# EAGLE design UBTB_MIX_old (EAGLE 9.4.2)
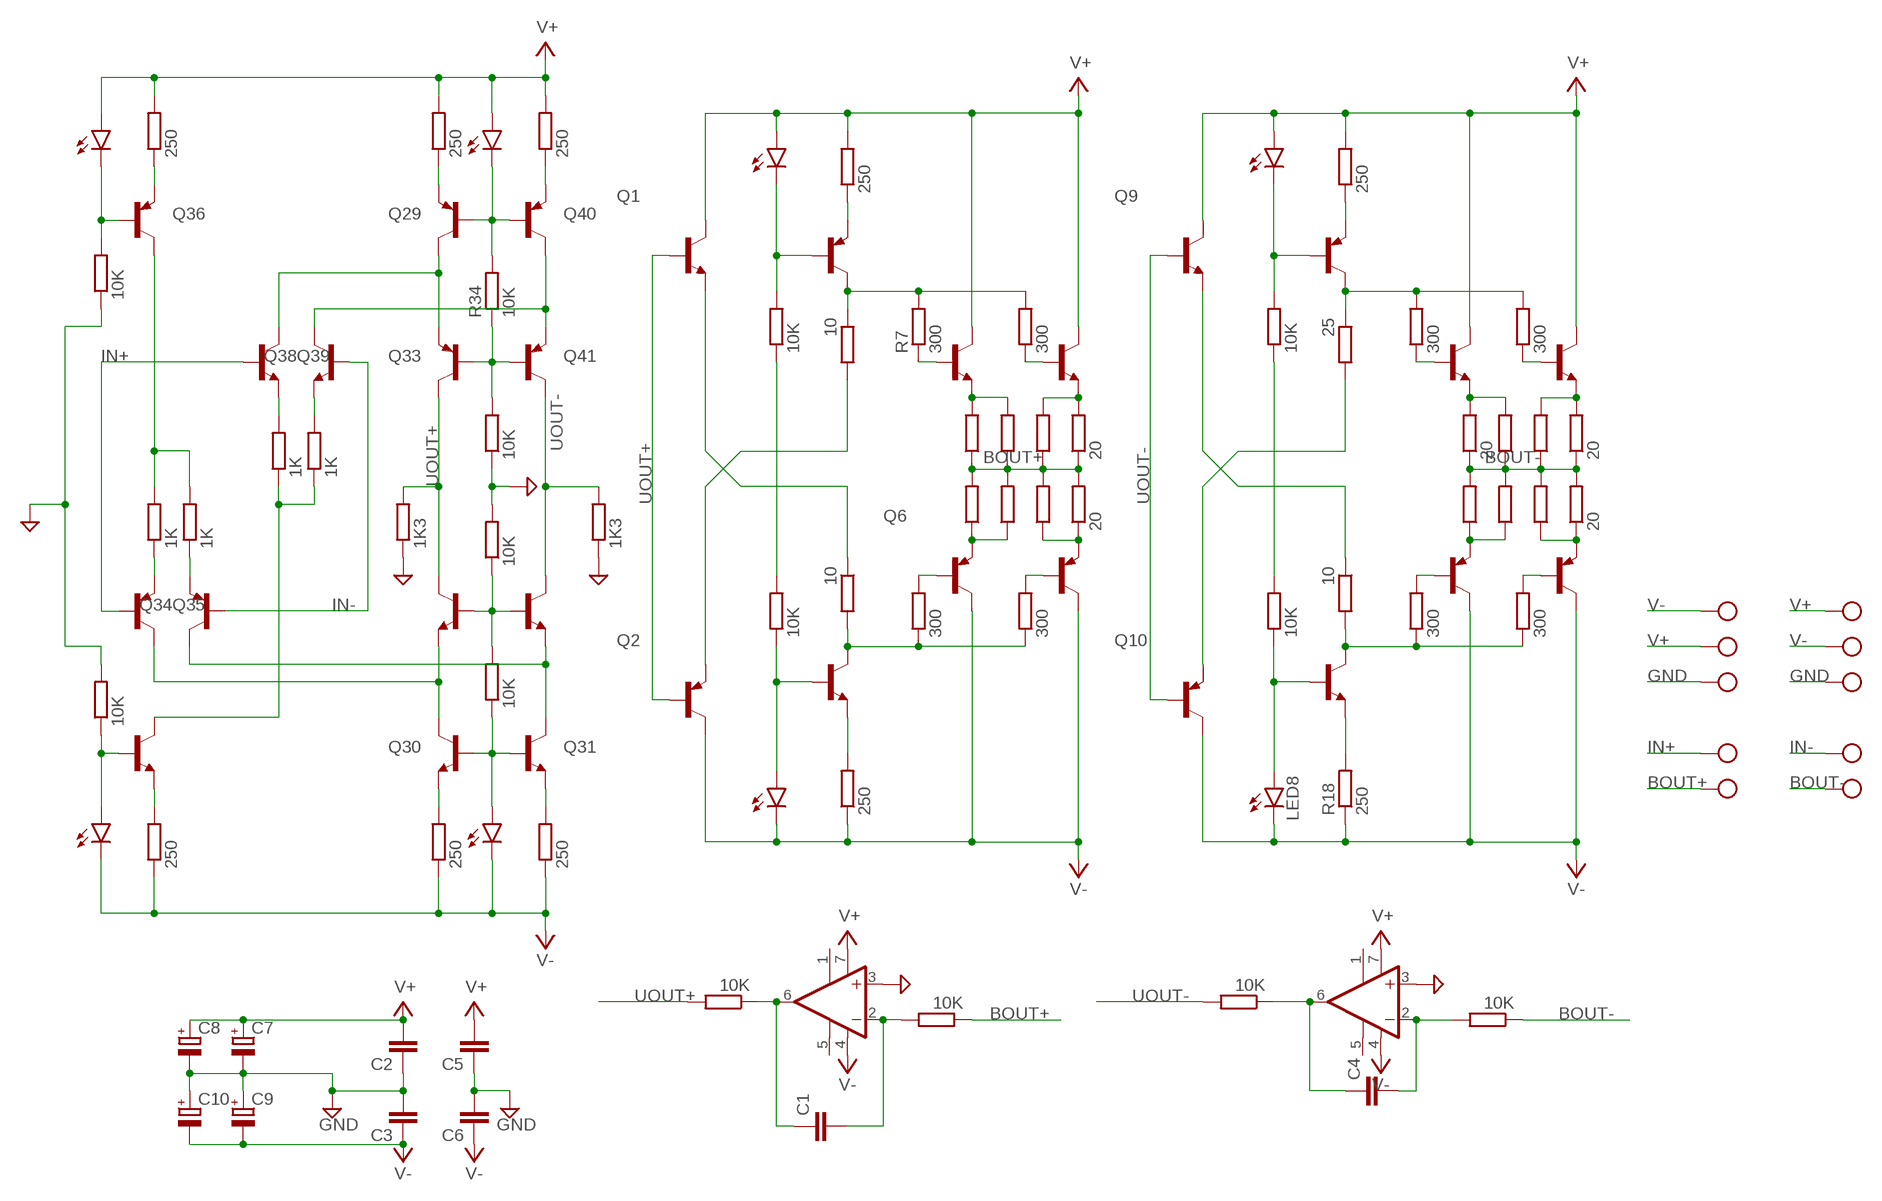
[diagram p0: schematic, sheet 1]

## Parts
C1  C-EUC1206  [C1206]
C2  C-EUC0805  [C0805]
C3  C-EUC0805  [C0805]
C4  C-EUC1206  [C1206]
C5  C-EUC0805  [C0805]
C6  C-EUC0805  [C0805]
C7  CPOL-EUF  [PANASONIC_F]
C8  CPOL-EUF  [PANASONIC_F]
C9  CPOL-EUF  [PANASONIC_F]
C10  CPOL-EUF  [PANASONIC_F]
IC1  OPA627U  [SO08]
IC2  OPA627U  [SO08]
LED1  LEDCHIPLED_1206  [CHIPLED_1206]
LED2  LEDCHIPLED_1206  [CHIPLED_1206]
LED3  LEDCHIPLED_1206  [CHIPLED_1206]
LED4  LEDCHIPLED_1206  [CHIPLED_1206]
LED5  LEDCHIPLED_1206  [CHIPLED_1206]
LED6  LEDCHIPLED_1206  [CHIPLED_1206]
LED7  LEDCHIPLED_1206  [CHIPLED_1206]
LED8  LEDCHIPLED_1206  [CHIPLED_1206]
Q1  TRANSISTOR_BC846-NPN-SOT23-BEC  [TRANSISTOR_SOT23-BEC]
Q2  TRANSISTOR_BC856B-PNP-SOT23-BEC  [TRANSISTOR_SOT23-BEC]
Q3  TRANSISTOR_BC846-NPN-SOT23-BEC  [TRANSISTOR_SOT23-BEC]
Q4  TRANSISTOR_BC856B-PNP-SOT23-BEC  [TRANSISTOR_SOT23-BEC]
Q5  TRANSISTOR_BC846-NPN-SOT23-BEC  [TRANSISTOR_SOT23-BEC]
Q6  TRANSISTOR_BC856B-PNP-SOT23-BEC  [TRANSISTOR_SOT23-BEC]
Q7  TRANSISTOR_BC856B-PNP-SOT23-BEC  [TRANSISTOR_SOT23-BEC]
Q8  TRANSISTOR_BC846-NPN-SOT23-BEC  [TRANSISTOR_SOT23-BEC]
Q9  TRANSISTOR_BC846-NPN-SOT23-BEC  [TRANSISTOR_SOT23-BEC]
Q10  TRANSISTOR_BC856B-PNP-SOT23-BEC  [TRANSISTOR_SOT23-BEC]
Q11  TRANSISTOR_BC846-NPN-SOT23-BEC  [TRANSISTOR_SOT23-BEC]
Q12  TRANSISTOR_BC856B-PNP-SOT23-BEC  [TRANSISTOR_SOT23-BEC]
Q13  TRANSISTOR_BC846-NPN-SOT23-BEC  [TRANSISTOR_SOT23-BEC]
Q14  TRANSISTOR_BC846-NPN-SOT23-BEC  [TRANSISTOR_SOT23-BEC]
Q15  TRANSISTOR_BC856B-PNP-SOT23-BEC  [TRANSISTOR_SOT23-BEC]
Q16  TRANSISTOR_BC856B-PNP-SOT23-BEC  [TRANSISTOR_SOT23-BEC]
Q26  BC847CSMD  [SOT23]
Q29  BC857CSMD  [SOT23-BEC]
Q30  BC847CSMD  [SOT23]
Q31  BC847CSMD  [SOT23]
Q32  BC847CSMD  [SOT23]
Q33  BC857CSMD  [SOT23-BEC]
Q34  BC857CSMD  [SOT23-BEC]
Q35  BC857CSMD  [SOT23-BEC]
Q36  BC857CSMD  [SOT23-BEC]
Q37  BC847CSMD  [SOT23]
Q38  BC847CSMD  [SOT23]
Q39  BC847CSMD  [SOT23]
Q40  BC857CSMD  [SOT23-BEC]
Q41  BC857CSMD  [SOT23-BEC]
R1  250  R-EU_MELF0204W  [MINI_MELF-0204W]
R2  250  R-EU_MELF0204W  [MINI_MELF-0204W]
R3  10K  R-EU_MELF0204W  [MINI_MELF-0204W]
R4  10K  R-EU_MELF0204W  [MINI_MELF-0204W]
R5  10  R-EU_MELF0204W  [MINI_MELF-0204W]
R6  10  R-EU_MELF0204W  [MINI_MELF-0204W]
R7  300  R-EU_MELF0204W  [MINI_MELF-0204W]
R8  300  R-EU_MELF0204W  [MINI_MELF-0204W]
R9  300  R-EU_MELF0204W  [MINI_MELF-0204W]
R10  300  R-EU_MELF0204W  [MINI_MELF-0204W]
R11  R-EU_MELF0204W  [MINI_MELF-0204W]
R12  R-EU_MELF0204W  [MINI_MELF-0204W]
R13  20  R-EU_MELF0204W  [MINI_MELF-0204W]
R14  20  R-EU_MELF0204W  [MINI_MELF-0204W]
R15  250  R-EU_MELF0204W  [MINI_MELF-0204W]
R16  10K  R-EU_MELF0204W  [MINI_MELF-0204W]
R17  10K  R-EU_MELF0204W  [MINI_MELF-0204W]
R18  250  R-EU_MELF0204W  [MINI_MELF-0204W]
R19  10K  R-EU_MELF0204W  [MINI_MELF-0204W]
R20  10K  R-EU_MELF0204W  [MINI_MELF-0204W]
R21  25  R-EU_MELF0204W  [MINI_MELF-0204W]
R22  250  R-EU_MELF0204W  [MINI_MELF-0204W]
R23  250  R-EU_MELF0204W  [MINI_MELF-0204W]
R24  10  R-EU_MELF0204W  [MINI_MELF-0204W]
R25  300  R-EU_MELF0204W  [MINI_MELF-0204W]
R26  300  R-EU_MELF0204W  [MINI_MELF-0204W]
R27  300  R-EU_MELF0204W  [MINI_MELF-0204W]
R28  300  R-EU_MELF0204W  [MINI_MELF-0204W]
R29  10K  R-EU_MELF0204W  [MINI_MELF-0204W]
R30  20  R-EU_MELF0204W  [MINI_MELF-0204W]
R31  R-EU_MELF0204W  [MINI_MELF-0204W]
R32  10K  R-EU_MELF0204W  [MINI_MELF-0204W]
R33  10K  R-EU_MELF0204W  [MINI_MELF-0204W]
R34  10K  R-EU_MELF0204W  [MINI_MELF-0204W]
R35  250  R-EU_MELF0204W  [MINI_MELF-0204W]
R36  250  R-EU_MELF0204W  [MINI_MELF-0204W]
R37  1K3  R-EU_MELF0204W  [MINI_MELF-0204W]
R38  1K3  R-EU_MELF0204W  [MINI_MELF-0204W]
R39  1K  R-EU_MELF0204W  [MINI_MELF-0204W]
R40  1K  R-EU_MELF0204W  [MINI_MELF-0204W]
R41  1K  R-EU_MELF0204W  [MINI_MELF-0204W]
R42  1K  R-EU_MELF0204W  [MINI_MELF-0204W]
R43  250  R-EU_MELF0204W  [MINI_MELF-0204W]
R44  250  R-EU_MELF0204W  [MINI_MELF-0204W]
R45  10K  R-EU_MELF0204W  [MINI_MELF-0204W]
R46  10K  R-EU_MELF0204W  [MINI_MELF-0204W]
R47  20  R-EU_MELF0204W  [MINI_MELF-0204W]
R48  10K  R-EU_MELF0204W  [MINI_MELF-0204W]
R49  20  R-EU_MELF0204W  [MINI_MELF-0204W]
R50  R-EU_MELF0204W  [MINI_MELF-0204W]
R51  10K  R-EU_MELF0204W  [MINI_MELF-0204W]
R52  R-EU_MELF0204W  [MINI_MELF-0204W]
R53  R-EU_MELF0204W  [MINI_MELF-0204W]
R54  R-EU_MELF0204W  [MINI_MELF-0204W]
R55  R-EU_MELF0204W  [MINI_MELF-0204W]
R56  R-EU_MELF0204W  [MINI_MELF-0204W]
R57  R-EU_MELF0204W  [MINI_MELF-0204W]
R58  R-EU_MELF0204W  [MINI_MELF-0204W]
X1  CON-PHOENIX-508_MKDSN1,5/3-5,08  [CON-PHOENIX-508_MKDSN1,5/3-5,08]
X2  CON-PHOENIX-508_MKDSN1,5/3-5,08  [CON-PHOENIX-508_MKDSN1,5/3-5,08]
X3  CON-PHOENIX-508_MKDSN1,5/2-5,08  [CON-PHOENIX-508_MKDSN1,5/2-5,08]
X4  CON-PHOENIX-508_MKDSN1,5/2-5,08  [CON-PHOENIX-508_MKDSN1,5/2-5,08]

## Nets
BOUT+: R11.1 R12.2 R13.1 R14.2 R17.1 R50.1 R52.1 R53.2 R54.2 X3.2
BOUT-: R30.1 R31.2 R47.1 R48.1 R49.2 R55.1 R56.1 R57.2 R58.2 X4.2
GND: C2.1 C3.2 C5.1 C6.2 C7.- C8.- C9.+ C10.+ IC1.3(+IN) IC2.3(+IN) R32.2 R33.1 R37.1 R38.1 R45.1 R46.2 X1.3 X2.3
IN+: Q35.B Q39.1(B) X3.1
IN-: Q34.B Q38.1(B) X4.1
N$1: C4.1 IC2.6(OUT) R51.1
N$3: C4.2 IC2.2(-IN) R48.2
N$4: Q2.E R5.2
N$5: Q3.E R2.2
N$6: Q4.E R1.1
N$7: LED5.C Q4.B R3.2
N$8: LED6.A Q3.B R4.1
N$9: Q4.C R5.1 R7.2 R10.2
N$10: Q3.C R6.2 R8.1 R9.1
N$11: Q1.E R6.1
N$12: R3.1 R4.2
N$13: Q5.B R7.1
N$14: Q5.E R11.2 R50.2
N$15: Q7.B R9.2
N$16: Q8.B R10.1
N$17: Q6.B R8.2
N$18: Q6.E R12.1 R53.1
N$19: C1.2 IC1.2(-IN) R17.2
N$20: Q8.E R13.2 R52.2
N$21: Q7.E R14.1 R54.1
N$22: C1.1 IC1.6(OUT) R16.1
N$25: Q11.E R18.2
N$26: Q12.E R15.1
N$27: LED7.C Q12.B R19.2
N$28: LED8.A Q11.B R20.1
N$29: Q12.C R21.1 R25.2 R28.2
N$30: Q11.C R24.2 R26.1 R27.1
N$31: Q10.E R21.2
N$32: Q9.E R24.1
N$33: R19.1 R20.2
N$34: Q13.B R25.1
N$35: Q15.B R26.2
N$36: Q14.B R28.1
N$37: Q16.B R27.2
N$38: Q13.E R30.2 R55.2
N$39: Q15.E R31.1 R58.1
N$41: Q14.E R47.2 R56.2
N$42: Q16.E R49.1 R57.1
N$93: Q30.2(E) R22.2
N$94: Q31.2(E) R23.2
N$95: Q31.3(C) Q32.2(E) Q34.C
N$96: Q30.3(C) Q35.C Q37.2(E)
N$97: LED1.A Q30.1(B) Q31.1(B) R29.1
N$98: Q32.1(B) Q37.1(B) R29.2 R32.1
N$101: Q33.B Q41.B R33.2 R34.1
N$102: Q29.C Q33.E Q39.3(C)
N$103: LED2.C Q29.B Q40.B R34.2
N$104: Q38.3(C) Q40.C Q41.E
N$105: Q29.E R35.1
N$106: Q40.E R36.1
N$108: LED3.C Q36.B R45.2
N$109: Q36.E R43.1
N$110: Q36.C R41.2 R42.2
N$111: Q34.E R42.1
N$112: Q35.E R41.1
N$115: Q39.2(E) R39.2
N$116: Q38.2(E) R40.2
N$117: Q26.3(C) R39.1 R40.1
N$118: Q26.2(E) R44.2
N$119: LED4.A Q26.1(B) R46.1
UOUT+: Q1.B Q2.B Q33.C Q37.3(C) R16.2 R37.2
UOUT-: Q9.B Q10.B Q32.3(C) Q41.C R38.2 R51.2
V+: C2.2 C5.2 C7.+ C8.+ IC1.7(V+) IC2.7(V+) LED2.A LED3.A LED5.A LED7.A Q1.C Q5.C Q8.C Q9.C Q13.C Q14.C R1.2 R15.2 R35.2 R36.2 R43.2 X1.2 X2.1
V-: C3.1 C6.1 C9.- C10.- IC1.4(V-) IC2.4(V-) LED1.C LED4.C LED6.C LED8.C Q2.C Q6.C Q7.C Q10.C Q15.C Q16.C R2.1 R18.1 R22.1 R23.1 R44.1 X1.1 X2.2
Unconnected: IC1.1(TRIM1) IC1.5(TRIM2) IC2.1(TRIM1) IC2.5(TRIM2)

## Library data of the parts
C1-C6 = Vwvwbg:C-EU: CAPACITOR, European symbol
C7-C10 = Vwvwbg:CPOL-EU: POLARIZED CAPACITOR, European symbol
IC1 IC2 = burr-brown:OPA627: Difet(R) Operational Amplifiers Precision, High-Speed; MF: TEXAS INSTRUMENTS; MPN: OPA627AU; OC_FARNELL: 1207067; OC_NEWARK: 30C4516
LED1-LED3 LED5-LED8 = led:LED: LED OSRAM: - CHIPLED LG R971, LG N971, LY N971, LG Q971, LY Q971, LO R971, LY R971 LH N974, LH R974 LS Q976, LO Q976, LY Q976 LO Q996 - Hyper CHIPLED LW Q18S LB Q993, LB Q99A, LB R99A - SideLED LS A670, LO A670, LY A670, LG A670, LP A670 LB A673, LV A673, LT A673, LW A673 LH A674 LY A675 LS A676, LA A676, LO A676, LY A676, LW A676 LS A679, LY A679, LG A679 - Hyper Micro SIDELED® LS Y876, LA Y876, LO Y876, LY Y876 LT Y87S - SmartLED LW L88C, LW L88S LB L89C, LB L89S, LG L890 LS L89K, LO L89K, LY L89K LS L896, LA L896, LO L896, LY L896 - TOPLED LS T670, LO T670, LY T670, LG T670, LP T670 LSG T670, LSP T670, LSY T670, LOP T670, LYG T670 LG T671, LOG T671, LSG T671 LB T673, LV T673, LT T673, LW T673 LH T674 LS T676, LA T676, LO T676, LY T676, LB T676, LH T676, LSB T676, LW T676 LB T67C, LV T67C, LT T67C, LS T67K, LO T67K, LY T67K, LW E67C LS E67B, LA E67B, LO E67B, LY E67B, LB E67C, LV E67C, LT E67C LW T67C LS T679, LY T679, LG T679 LS T770, LO T770, LY T770, LG T770, LP T770 LB T773, LV T773, LT T773, LW T773 LH T774 LS E675, LA E675, LY E675, LS T675 LS T776, LA T776, LO T776, LY T776, LB T776 LHGB T686 LT T68C, LB T68C - Hyper Mini TOPLED® LB M676 - Mini TOPLED Santana® LG M470 LS M47K, LO M47K, LY M47K Source: http://www.osram.convergy.de LUXEON: - LUMILED® LXK2-PW12-R00, LXK2-PW12-S00, LXK2-PW14-U00, LXK2-PW14-V00 LXK2-PM12-R00, LXK2-PM12-S00, LXK2-PM14-U00 LXK2-PE12-Q00, LXK2-PE12-R00, LXK2-PE12-S00, LXK2-PE14-T00, LXK2-PE14-U00 LXK2-PB12-K00, LXK2-PB12-L00, LXK2-PB12-M00, LXK2-PB14-N00, LXK2-PB14-P00, LXK2-PB14-Q00 LXK2-PR12-L00, LXK2-PR12-M00, LXK2-PR14-Q00, LXK2-PR14-R00 LXK2-PD12-Q00, LXK2-PD12-R00, LXK2-PD12-S00 LXK2-PH12-R00, LXK2-PH12-S00 LXK2-PL12-P00, LXK2-PL12-Q00, LXK2-PL12-R00 Source: www.luxeon.com KINGBRIGHT: KA-3528ASYC Source: www.kingbright.com
LED4 = led:LED: LED OSRAM: - CHIPLED LG R971, LG N971, LY N971, LG Q971, LY Q971, LO R971, LY R971 LH N974, LH R974 LS Q976, LO Q976, LY Q976 LO Q996 - Hyper CHIPLED LW Q18S LB Q993, LB Q99A, LB R99A - SideLED LS A670, LO A670, LY A670, LG A670, LP A670 LB A673, LV A673, LT A673, LW A673 LH A674 LY A675 LS A676, LA A676, LO A676, LY A676, LW A676 LS A679, LY A679, LG A679 - Hyper Micro SIDELED® LS Y876, LA Y876, LO Y876, LY Y876 LT Y87S - SmartLED LW L88C, LW L88S LB L89C, LB L89S, LG L890 LS L89K, LO L89K, LY L89K LS L896, LA L896, LO L896, LY L896 - TOPLED LS T670, LO T670, LY T670, LG T670, LP T670 LSG T670, LSP T670, LSY T670, LOP T670, LYG T670 LG T671, LOG T671, LSG T671 LB T673, LV T673, LT T673, LW T673 LH T674 LS T676, LA T676, LO T676, LY T676, LB T676, LH T676, LSB T676, LW T676 LB T67C, LV T67C, LT T67C, LS T67K, LO T67K, LY T67K, LW E67C LS E67B, LA E67B, LO E67B, LY E67B, LB E67C, LV E67C, LT E67C LW T67C LS T679, LY T679, LG T679 LS T770, LO T770, LY T770, LG T770, LP T770 LB T773, LV T773, LT T773, LW T773 LH T774 LS E675, LA E675, LY E675, LS T675 LS T776, LA T776, LO T776, LY T776, LB T776 LHGB T686 LT T68C, LB T68C - Hyper Mini TOPLED® LB M676 - Mini TOPLED Santana® LG M470 LS M47K, LO M47K, LY M47K Source: http://www.osram.convergy.de LUXEON: - LUMILED® LXK2-PW12-R00, LXK2-PW12-S00, LXK2-PW14-U00, LXK2-PW14-V00 LXK2-PM12-R00, LXK2-PM12-S00, LXK2-PM14-U00 LXK2-PE12-Q00, LXK2-PE12-R00, LXK2-PE12-S00, LXK2-PE14-T00, LXK2-PE14-U00 LXK2-PB12-K00, LXK2-PB12-L00, LXK2-PB12-M00, LXK2-PB14-N00, LXK2-PB14-P00, LXK2-PB14-Q00 LXK2-PR12-L00, LXK2-PR12-M00, LXK2-PR14-Q00, LXK2-PR14-R00 LXK2-PD12-Q00, LXK2-PD12-R00, LXK2-PD12-S00 LXK2-PH12-R00, LXK2-PH12-S00 LXK2-PL12-P00, LXK2-PL12-Q00, LXK2-PL12-R00 Source: www.luxeon.com KINGBRIGHT: KA-3528ASYC Source: www.kingbright.com; SPICEPREFIX: D
Q1 Q3 Q5 Q8 Q9 Q11 Q13 Q14 = Vwvwbg:TRANSISTOR_*-NPN-: NPN Transistror BF959 corrected 2008.03.06
Q2 Q4 Q6 Q7 Q10 Q12 Q15 Q16 = Vwvwbg:TRANSISTOR_*-PNP-: PNP Transistror
Q26 Q30-Q32 Q37-Q39 = transistor-npn:BC847*: NPN Transistor; SPICEPREFIX: Q
Q29 Q33-Q36 Q40 Q41 = transistor-pnp:BC857*: PNP Transistror; SPICEPREFIX: Q
R1-R43 R45-R58 = Vwvwbg:R-EU_: RESISTOR, European symbol
R44 = Vwvwbg:R-EU_: RESISTOR, European symbol; SPICEPREFIX: R
X1 X2 = Vwvwbg:CON-PHOENIX-508_MKDSN1,5/3-5,08: MKDSN 1,5/ 3-5,08 Printklemme Nennstrom: 13,5 A Nennspannung: 250 V Rastermaß: 5,08 mm Polzahl: 3 Anschlussart: Schraubanschluss Montage: Löten Anschlussrichtung Leiter/Platine: 0 ° Artikelnummer: 1729131 Source: http://eshop.phoenixcontact.com .. 1729131.pdf
X3 X4 = Vwvwbg:CON-PHOENIX-508_MKDSN1,5/2-5,08: MKDSN 1,5/ 2-5,08 Printklemme Nennstrom: 13,5 A Nennspannung: 250 V Rastermaß: 5,08 mm Polzahl: 2 Anschlussart: Schraubanschluss Montage: Löten Anschlussrichtung Leiter/Platine: 0 ° Artikelnummer: 1729128 Source: http://eshop.phoenixcontact.com .. 1729128.pdf

## Board
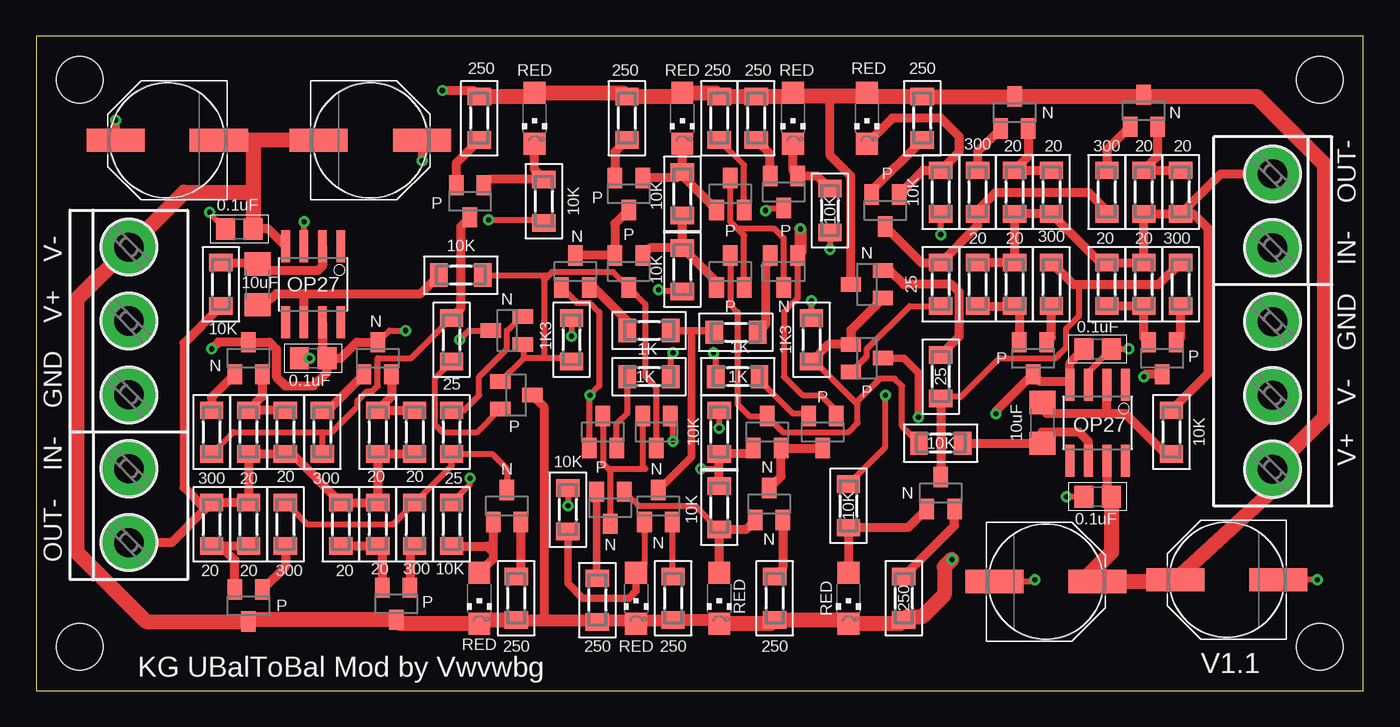
[diagram p1: board, top side]
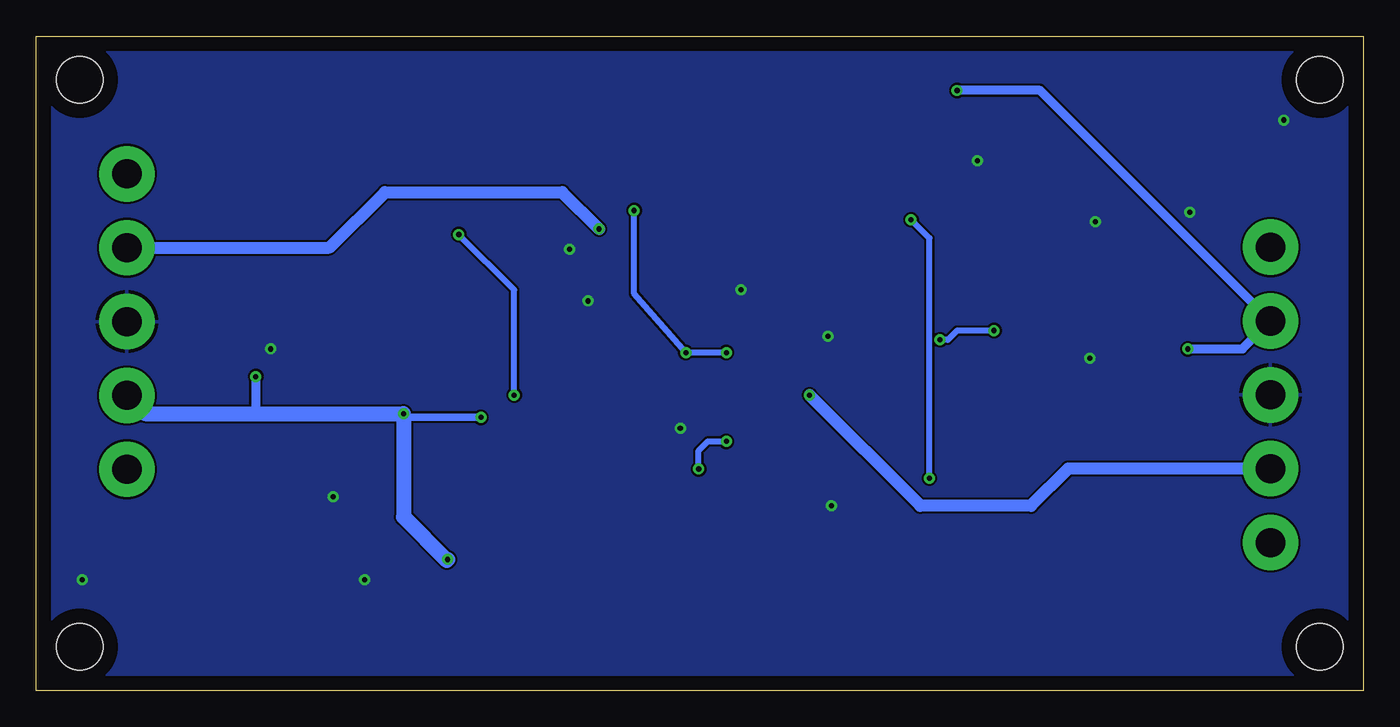
[diagram p2: board, bottom side, seen from below]

Size 91.3 x 45 mm. Coordinates in mm from the lower left corner, seen from the top.
Outline: 0,0 91.3,0 91.3,45 0,45 0,0
Copper layers (1*16): Top 0.035mm / dielectric 1.5mm / Bottom 0.035mm
Design rules "default *": minimum track width 6mil, minimum drill 0.35mm, track to track 6mil, track to pad 6mil, pad to pad 6mil, via to via 6mil, smd to smd 6mil, copper to edge 40mil, drill to drill 6mil, minimum pad ring 10mil, minimum via ring 8mil, stop-mask expansion 4mil, vias tented up to drill 0.35mm, thermal gap 10mil
Holes 3.2 mm at 3,42 88.3,3 88.3,42 3,3

### Footprints (pad centres in the part's own frame; a part is rotated, then mirrored left to right if it is on the bottom)
C1206 = smd 1.6 x 1.8: 1 -1.4,0; 2 1.4,0
C0805 = smd 1.3 x 1.5: 1 -0.95,0; 2 0.95,0
PANASONIC_F = smd 4 x 1.6: + 3.55,0; - -3.55,0
SO08 = smd 0.61 x 2.21: 1 -1.905,-2.616; 2 -0.635,-2.616; 3 0.635,-2.616; 4 1.905,-2.616; 5 1.905,2.616; 6 0.635,2.616; 7 -0.635,2.616; 8 -1.905,2.616
CHIPLED_1206 = smd 1.5 x 1.5: A 0,-1.75; C 0,1.75
TRANSISTOR_SOT23-BEC = smd 1 x 1.4: B -0.95,-1.1; C 0,1.1; E 0.95,-1.1
SOT23 = smd 1 x 1.4: 1 -0.95,-1.1; 2 0.95,-1.1; 3 0,1.1
SOT23-BEC = smd 1 x 1.4: B -0.95,-1.1; C 0,1.1; E 0.95,-1.1
MINI_MELF-0204W = smd 1.2 x 1.6: 1 -1.5,0; 2 1.5,0
CON-PHOENIX-508_MKDSN1,5/3-5,08 = drill 2 pad 3.81: 1 -7.641,0.025; 2 -2.561,0.025; 3 2.519,0.025
CON-PHOENIX-508_MKDSN1,5/2-5,08 = drill 2 pad 3.81: 1 -2.561,0.025; 2 2.519,0.025

### Placement (x,y rotation side)
C1  15.24,27.94 90 top
C2  73.03,13.34 0 top
C3  13.97,31.75 180 top
C4  69.22,18.41 90 top
C5  19.05,22.86 0 top
C6  73.03,23.5 0 top
C7  69.47,7.49 0 top
C8  81.92,7.62 180 top
C9  22.99,37.85 0 top
C10  9.02,37.85 180 top
IC1  19.05,27.94 180 top
IC2  73.03,18.41 180 top
LED1  46.99,6.35 180 top
LED2  44.45,39.37 180 top
LED3  52.07,39.37 180 top
LED4  41.27,6.35 180 top
LED5  34.29,39.37 180 top
LED6  30.48,6.35 180 top
LED7  57.15,39.37 180 top
LED8  55.88,6.35 180 top
Q1  32.38,24.77 90 top
Q2  33.02,20.32 270 top
Q3  32.38,12.7 0 top
Q4  29.84,33.66 180 top
Q5  14.61,22.86 0 top
Q6  14.61,5.84 180 top
Q7  24.77,5.97 180 top
Q8  23.5,22.86 0 top
Q9  57.15,27.94 90 top
Q10  57.15,22.86 270 top
Q11  62.23,13.59 0 top
Q12  58.42,33.02 180 top
Q13  67.31,39.75 0 top
Q14  76.2,39.88 0 top
Q15  68.58,22.86 180 top
Q16  77.47,22.86 180 top
Q26  42.8,12.7 0 top
Q29  40.77,34.16 180 top
Q30  39.5,12.57 180 top
Q31  50.42,12.83 0 top
Q32  50.29,17.78 0 top
Q33  40.77,28.83 180 top
Q34  54.1,17.78 180 top
Q35  38.99,17.78 0 top
Q36  51.44,34.29 180 top
Q37  42.67,17.78 180 top
Q38  51.44,28.83 180 top
Q39  37.08,28.83 0 top
Q40  47.75,34.16 0 top
Q41  47.75,28.83 0 top
R1  30.48,39.37 90 top
R2  33.02,6.35 90 top
R3  34.92,33.66 90 top
R4  28.57,11.43 90 top
R5  28.57,24.13 270 top
R6  28.57,17.78 270 top
R7  12.06,17.78 270 top
R8  17.14,11.43 270 top
R9  26.04,11.43 270 top
R10  19.68,17.78 270 top
R11  14.61,17.78 90 top
R12  14.61,11.43 90 top
R13  26.04,17.78 90 top
R14  20.95,11.43 90 top
R15  60.96,39.37 90 top
R16  29.21,28.57 0 top
R17  12.7,27.94 90 top
R18  59.69,6.35 90 top
R19  62.23,34.29 90 top
R20  55.88,12.7 90 top
R21  62.23,27.94 270 top
R22  38.61,6.22 90 top
R23  50.8,6.35 90 top
R24  62.23,21.59 270 top
R25  64.77,34.29 270 top
R26  69.85,27.94 270 top
R27  78.74,27.94 270 top
R28  73.66,34.29 270 top
R29  46.99,12.57 90 top
R30  67.31,34.29 90 top
R31  67.31,27.94 90 top
R32  46.99,17.78 90 top
R33  44.45,28.96 90 top
R34  44.45,34.16 90 top
R35  40.64,39.37 90 top
R36  46.99,39.37 90 top
R37  36.83,24.13 270 top
R38  53.34,24.13 270 top
R39  42.16,24.77 180 top
R40  48.13,24.64 0 top
R41  42.16,21.59 0 top
R42  48.26,21.59 180 top
R43  49.53,39.37 90 top
R44  43.81,6.35 90 top
R45  54.61,33.02 90 top
R46  36.58,12.45 90 top
R47  78.74,34.29 90 top
R48  78.11,17.78 270 top
R49  73.66,27.94 90 top
R50  17.14,17.78 90 top
R51  62.23,17.02 180 top
R52  23.5,17.78 90 top
R53  12.06,11.43 90 top
R54  23.5,11.43 90 top
R55  69.85,34.29 90 top
R56  76.2,34.29 90 top
R57  76.2,27.94 90 top
R58  64.77,27.94 90 top
X1  6.35,22.86 270 top
X2  85.09,22.86 90 top
X3  6.35,12.7 270 top
X4  85.09,33.02 90 top

### Tracks (layer width: path | path; a pad name or v marks a point on that pad's centre or on a via)
BOUT+
  Top 0.61: 11.63,12.5 R53.2 R12.2 R11.1 R50.1 17.61,16.28 R14.2 R54.2 R52.1 R13.1 | 11.63,12.5 9.32,10.18 X3.2 | R17.1 10.16,23.9 10.16,13.97 11.63,12.5
BOUT-
  Top 0.61: R58.2 R31.2 R30.1 R55.1 73.2,29.44 R49.2 R57.2 R56.1 R47.1 | R47.1 81.49,35.54 X4.2 | R48.1 80.64,21.82 80.64,31.75 79.61,32.79 R47.1
GND  (via drill 0.35)
  Top 0.406: IC2.3 72.39,21.91 72.87,22.39 73.08,22.6 C6.2 v75.18,23.5 | C2.1 v70.87,13.34 | v68.71,7.62 68.58,7.49 C7.- | v88.14,7.62 C8.- | R38.1 v53.34,26.8 | R45.1 v54.61,30.35 | R33.1 42.9,27.46 v42.8,27.56 | R32.2 v46.99,18.03 | R46.2 v36.58,12.7 | C5.1 v18.82,22.86 | IC1.3 v18.41,32.26 | C3.2 11.94,32.83 v11.94,32.89 | R37.1 v36.83,24.38
  Top 0.61: C9.+ v26.54,36.45 | C10.+ v5.47,39.24 v5.46,39.24
  pour Bottom: 0,46.99 91.44,46.99 91.44,-2.54 0,-2.54
IN+  (via drill 0.35)
  Top 0.406: Q39.1 37.19,26.67 38.1,26.67 38.73,26.04 38.73,20.95 v38.1,20.32 38.04,20.26 Q35.B
  Bottom 0.813: X3.1 20.3,15.26 22.86,12.7 30.48,12.7 v38.1,20.32
IN-  (via drill 0.35)
  Top 0.406: Q38.1 52.38,26.98 52.08,26.67 52.07,26.67 51.44,26.04 51.44,21.59 52.7,20.32 53.98,20.32 55.05,19.24 Q34.B
  Top 0.813: v52.58,31.75 52.58,30.12 Q38.1
  Bottom 0.813: X4.1 71.14,30.46 67.31,34.29 55.12,34.29 v52.58,31.75
N$1
  Top 0.61: R51.1 69.21,17.02 C4.1 69.22,17.78 71.75,17.78 72.39,17.14 IC2.6
N$3
  Top 0.61: R48.2 77.7,16.28 74.93,19.05 73.66,19.05 | 73.66,19.05 IC2.2 | 73.66,19.05 69.53,19.05 C4.2
N$4
  Top 0.406: R5.2 27.42,21.47 27.42,18.3 27.94,17.78 30.33,17.78 Q2.E
N$5
  Top 0.61: Q3.E 33.34,8.16 R2.2
N$6
  Top 0.61: R1.1 28.89,36.28 Q4.E
N$7
  Top 0.61: Q4.B 31.2,35.16 R3.2 34.29,35.79 LED5.C
N$8
  Top 0.61: Q3.B 31.43,9.53 | 31.43,9.53 31.43,9.05 LED6.A | R4.1 31.03,9.93 31.43,9.53
N$9
  Top 0.406: R7.2 13.56,17.78 19.68,17.78 | 19.68,17.78 20.32,17.78 22.1,19.56 22.1,19.94 22.73,20.57 23.11,20.57 23.5,20.95 23.5,22.86 25.8,22.86 R5.1 | R10.2 19.68,17.78
  Top 0.61: Q4.C 29.21,31.92 29.21,26.27 R5.1
N$10
  Top 0.406: R8.1 18.64,11.43 24.54,11.43 R9.1 28.57,15.47 R6.2 31.34,16.28 32.38,15.24 Q3.C
N$11
  Top 0.406: R6.1 29.44,19.28 30.48,20.32 30.48,21.59 32.38,23.5 32.38,24.77 33.34,25.71 Q1.E
N$12  (via drill 0.35)
  Top 0.406: R4.2 29.84,14.2 v29.84,14.61 | v31.11,32.38 34.7,32.38 R3.1
  Bottom 0.406: v29.84,14.61 29.84,31.11 v31.11,32.38
N$13
  Top 0.61: Q5.B 12.06,20.17 R7.1
N$14
  Top 0.61: R50.2 R11.2 15.55,20.23 Q5.E
N$15
  Top 0.61: R9.2 25.71,9.61 Q7.B
N$16
  Top 0.61: Q8.B 20.07,19.28 R10.1
N$17
  Top 0.61: R8.2 17.14,8.53 Q6.B
N$18
  Top 0.61: R12.1 12.7,9.93 | 12.7,9.93 R53.1 | Q6.E 13.65,8.97 12.7,9.93
N$19
  Top 0.61: IC1.2 19.68,29.21 19.37,28.89 15.68,28.89 15.62,28.83 15.24,29.21 C1.2 14.69,29.44 R17.2
N$20
  Top 0.61: R13.2 R52.2 24.45,20.23 Q8.E
N$21
  Top 0.61: Q7.E 23.82,9.61 R54.1 R14.1
N$22
  Top 0.61: C1.1 16.2,26.99 16.51,27.3 18.41,27.3 | R16.1 26.44,27.3 18.41,27.3 | IC1.6 18.41,27.3
N$25
  Top 0.61: R18.2 63.18,11.34 Q11.E
N$26
  Top 0.61: R15.1 57.47,34.38 Q12.E
N$27
  Top 0.61: Q12.B 61.04,35.79 R19.2 63.5,37.06 63.5,38.1 62.23,39.37 58.9,39.37 LED7.C
N$28
  Top 0.61: LED8.A R20.1 59.99,11.2 Q11.B
N$29
  Top 0.61: Q12.C 60.9,29.44 R21.1 64.77,31.98 R25.2 64.77,33.02 66.04,34.29 72.39,34.29 73.66,33.02 R28.2
N$30
  Top 0.406: 71.75,27.94 71.75,25.78 70.87,24.89 70.87,23.62 70.39,23.14 70.39,23.11 70.13,22.86 66.27,22.86 63.62,20.2 62.34,20.2 R24.2
  Top 0.61: R26.1 71.35,27.94 71.75,27.94 77.24,27.94 R27.1 | R24.2 Q11.C
N$31
  Top 0.406: Q10.E 57.15,23.01 57.15,23.5 60.09,26.44 R21.2
N$32
  Top 0.61: R24.1 63.5,24.36 63.5,27.4 62.96,27.94 59.69,27.94 58.74,28.89 Q9.E
N$33  (via drill 0.35)
  Top 0.406: R20.2 58.42,16.74 v58.42,20.32 | v62.23,31.37 R19.1
  Bottom 0.406: v58.42,20.32 58.42,27.56 v62.23,31.37
N$34
  Top 0.61: Q13.B 64.77,37.06 R25.1
N$35
  Top 0.61: Q15.B 69.85,24.28 R26.2
N$36
  Top 0.61: Q14.B 73.66,37.19 R28.1
N$37
  Top 0.61: Q16.B 78.74,24.28 R27.2
N$38
  Top 0.61: Q13.E 68.26,36.74 R30.2 R55.2
N$39
  Top 0.61: R58.1 R31.1 67.63,26.12 Q15.E
N$41
  Top 0.61: Q14.E 77.15,36.74 R56.2 R47.2
N$42
  Top 0.61: Q16.E 76.2,24.28 R57.1 R49.1
N$93
  Top 0.508: Q30.2 38.55,7.72
  Top 0.61: 38.55,7.72 R22.2
N$94
  Top 0.61: Q31.2 51.37,8.42 R23.2
N$95
  Top 0.61: Q31.3 51.24,14.75 Q32.2 Q34.C
N$96
  Top 0.406: Q35.C 38.99,15.62 39.37,15.24 | 39.37,15.24 41.91,15.24 41.72,15.43 Q37.2 | Q30.3 39.5,15.11 39.37,15.24
N$97
  Top 0.406: Q30.1 41.42,12.7 45.36,12.7 R29.1
  Top 0.61: LED1.A R29.1 48.81,11.07 Q31.1
N$98  (via drill 0.35)
  Top 0.406: Q37.1 43.81,18.69 v43.81,17.14 | v45.72,15.24 46.99,15.24
  Top 0.61: R29.2 46.99,15.24 R32.1 48.94,16.28 Q32.1
  Bottom 0.406: v45.72,15.24 45.72,16.51 45.09,17.14 v43.81,17.14
N$101
  Top 0.61: Q41.B 46.8,28.1 R33.2 | R33.2 R34.1 | R33.2 42.24,30.46 Q33.B
N$102
  Top 0.61: Q29.C 39.82,32.11 Q33.E Q39.3
N$103
  Top 0.61: Q40.B 44.45,35.41 R34.2 | R34.2 LED2.C | R34.2 44.05,35.26 Q29.B
N$104
  Top 0.406: Q41.E 48.7,31.31 48.26,31.75 | Q40.C 47.75,32.26 48.26,31.75 | Q38.3 51.44,31.11 50.8,31.75 48.26,31.75
N$105
  Top 0.61: R35.1 39.82,37.05 Q29.E
N$106
  Top 0.406: Q40.E 48.7,36.16 R36.1
N$108
  Top 0.61: R45.2 53.74,35.39 Q36.B 52.07,35.7 LED3.C
N$109
  Top 0.61: Q36.E 50.48,36.91 R43.1
N$110  (via drill 0.35)
  Top 0.406: v50.16,33.02 50.34,33.19 Q36.C | R41.2 43.66,23.34 v43.81,23.24 | R42.2 46.76,23.09 v46.61,23.24
  Bottom 0.406: v50.16,33.02 50.16,27.3 v46.61,23.24 v43.81,23.24
N$111
  Top 0.406: Q34.E 52.98,19.05 52.07,19.05 49.76,21.36 R42.1
N$112
  Top 0.406: Q35.E 39.94,18.35 40.66,19.07 R41.1
N$115
  Top 0.61: R39.2 40.66,25.4 38.34,27.73 Q39.2
N$116
  Top 0.61: Q38.2 50.48,29.53 50.16,29.21 50.16,25.17 R40.2
N$117
  Top 0.508: Q26.3 45.09,16.09 45.09,24.77 | R40.1 46.51,24.77 45.09,24.77 | 45.09,24.77 R39.1
N$118
  Top 0.406: Q26.2 43.75,7.92 R44.2
N$119
  Top 0.406: Q26.1 41.85,8.67 LED4.A
  Top 0.508: R46.1 36.58,7.37 37.59,6.35 40.77,6.35 41.27,6.86 LED4.A
UOUT+
  Top 0.406: Q37.3 42.67,20.83 41.91,21.59 41.91,26.59 Q33.C 39.71,28.79 35.49,28.79 35.28,28.57 | R37.2 36.6,22.86 34.92,22.86 | 33.51,22.86 Q2.B | 34.92,22.86 33.51,22.86 | Q1.B 33.51,23.79 33.51,22.86 | 35.28,28.57 34.92,28.22 34.92,22.86 | R16.2 35.28,28.57
UOUT-
  Top 0.406: Q41.C 47.75,26.54 48.26,26.04 48.26,19.68 49.06,18.88 Q32.3 51.39,17.78 55.88,17.78 56.52,18.41 56.52,19.68 56.39,19.81 | R38.2 53.57,22.63 56.39,19.81 | R51.2 59.56,18.18 59.56,20.95 59.05,21.46 58.04,21.46 56.39,19.81
  Top 0.61: Q9.B 56.05,24.79 Q10.B 54.52,23.81 R38.2
V+  (via drill 0.35)
  Top 0.406: Q8.C 24.3,24.77 v25.4,24.77 | v29.11,24.13 29.75,24.77 Q1.C
  Top 0.61: C2.2 73.66,13.65 IC2.7 | Q9.C 56.05,35.39 54.61,36.83 54.61,40.87 | C5.2 19.68,23.18 IC1.7 | C5.2 20,21.91 19.05,20.95 17.15,20.95 16.51,21.59 16.51,23.49 16.05,23.96 Q5.C 12.53,23.96 v12.06,23.5 | v27.94,41.27 30.07,41.27 R1.2 | C5.2 20.95,22.86 22.05,23.96 Q8.C
  Top 1.016: R1.2 34.04,40.87 LED5.A 40.39,41.12 R35.2 44.2,40.87 LED2.A 46.74,41.12 R36.2 R43.2 51.82,40.87 | 51.82,40.87 LED3.A | 51.82,40.87 54.61,40.87 56.9,40.87 LED7.A 57.4,40.87 R15.2 60.98,40.85 Q13.C 76.07,40.85 Q14.C 76.33,40.85 83.99,40.85 88.63,36.22 88.63,18.78 X2.1 85.06,13.78 C8.+ 78.24,7.49 C7.+ 72.16,7.69 73.97,9.51 C2.2
  Bottom 0.406: v25.4,24.77 27.94,24.77 28.57,24.13 v29.11,24.13
  Bottom 0.61: v12.06,23.5 8.3,23.5 X1.2 22.23,41.27 v27.94,41.27
V-  (via drill 0.35)
  Top 0.406: LED1.C 46.74,4.85
  Top 0.508: Q10.C 59.69,22.86 60.71,21.84 v60.71,18.8
  Top 0.61: v66.04,19.05 66.04,19.22 Q15.C 69.07,21.27 71.12,21.27 IC2.4 71.12,22.54 C6.1 | Q16.C 76.37,21.76 v76.2,21.59 | IC1.4 15.95,31.75 C3.1 | Q2.C 34.92,19.52 34.92,5.1 35.18,4.85
  Top 0.813: 46.74,4.85 R44.1 41.52,4.85 38.73,4.85 R22.1 38.48,4.85 35.18,4.85 R2.1
  Top 1.016: LED1.C 50.55,4.6 R23.1 55.63,4.85 LED8.C 59.44,4.6 R18.1 59.92,5.08 60.96,5.08 62.48,6.6 62.48,8.51 v62.99,9.02 | R2.1 30.73,4.85 LED6.C 25.03,4.6 Q7.C 14.73,4.87 Q6.C 7.58,4.74 2.79,9.53 2.79,26.92 X1.1 10.16,34.29 14.92,34.29 | C9.- C10.- 14.92,37.85 14.92,34.29 | 14.92,34.29 C3.1 | 41.52,4.85 LED4.C
  Bottom 0.508: v60.71,18.8 65.79,18.8 v66.04,19.05
  Bottom 0.61: v76.2,21.59 76.2,19.05
  Bottom 1.016: X2.2 83.82,19.05 76.2,19.05 v66.04,19.05 66.04,11.94 63.06,8.95 v62.99,9.02

### Text on the board
tPlace: 250 | RED | 250 | RED | 250 | 250 | RED | RED | 250 | N | N | 300 | 20 | 20 | 300 | 20 | 20 | P | P | 10K | P | 10K | 10K | 0.1uF | 10K | P | P | 10K | N | P | 20 | 20 | 300 | 20 | 20 | 300 | N | 10K | 10uF | OP27 | 25 | N | V+ V- GND IN- OUT- | P | N | 10K | N | 0.1uF | 1K3 | 1K | 1K3 | 1K | P | P | N | 1K | 1K | 25 | 0.1uF | 25 | P | OUT- IN- GND V+ V- | P | P | 10K | 10uF | OP27 | 10K | 10K | 10K | 300 | 20 | 20 | 300 | 20 | 20 | 25 | N | P | N | N | N | 10K | 10K | 0.1uF | N | N | N | 20 | 20 | 300 | 20 | 20 | 300 | 10K | P | P | RED | RED | 250 | RED | 250 | 250 | RED | 250 | 250 | KG UBalToBal Mod by Vwvwbg | V1.1